# Altium schematic sheet Servo_Connector.SchDoc
size A4
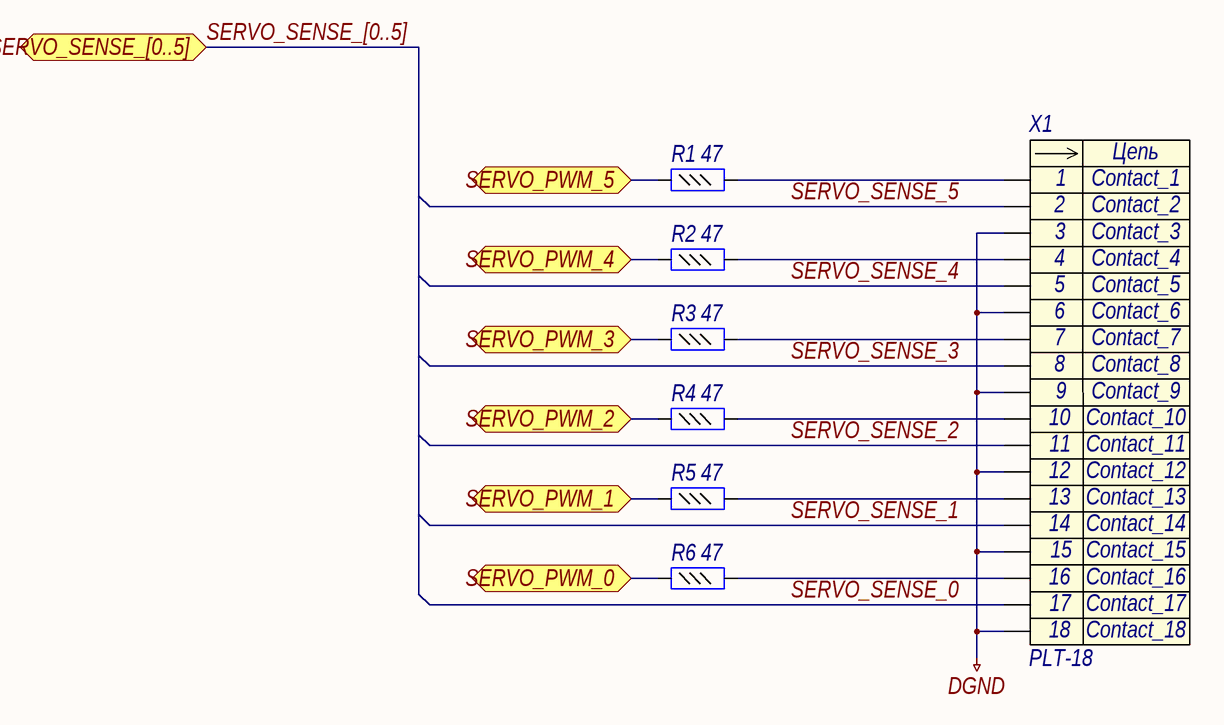
[diagram p0: Servo_Connector.SchDoc]

## Parts
R1  value 47  [R0603]  (hidden comment: Resistor_0,062Вт)
R2  value 47  [R0603]  (hidden comment: Resistor_0,062Вт)
R3  value 47  [R0603]  (hidden comment: Resistor_0,062Вт)
R4  value 47  [R0603]  (hidden comment: Resistor_0,062Вт)
R5  value 47  [R0603]  (hidden comment: Resistor_0,062Вт)
R6  value 47  [R0603]  (hidden comment: Resistor_0,062Вт)
X1  PLT-18  [PLT-18]

## Ports
SERVO_PWM_0, SERVO_PWM_1, SERVO_PWM_2, SERVO_PWM_3, SERVO_PWM_4, SERVO_PWM_5, SERVO_SENSE_[0..5]

## Nets
DGND: X1.3 X1.6 X1.9 X1.12 X1.15 X1.18
SERVO_PWM_0: R6.1 ; port SERVO_PWM_0
SERVO_PWM_1: R5.1 ; port SERVO_PWM_1
SERVO_PWM_2: R4.1 ; port SERVO_PWM_2
SERVO_PWM_3: R3.1 ; port SERVO_PWM_3
SERVO_PWM_4: R2.1 ; port SERVO_PWM_4
SERVO_PWM_5: R1.1 ; port SERVO_PWM_5
SERVO_SENSE_0: X1.17
SERVO_SENSE_1: X1.14
SERVO_SENSE_2: X1.11
SERVO_SENSE_3: X1.8
SERVO_SENSE_4: X1.5
SERVO_SENSE_5: X1.2
NetR1_2: R1.2 X1.1
NetR2_2: R2.2 X1.4
NetR3_2: R3.2 X1.7
NetR4_2: R4.2 X1.10
NetR5_2: R5.2 X1.13
NetR6_2: R6.2 X1.16

## Buses and harness runs
bus SERVO_SENSE_[0..5] = port SERVO_SENSE_[0..5]

## Notes on the sheet
- (in symbol connect129) Цепь

## Library data of the parts
R1-R6 = res431: Резистор; Manufacture: Yageo; Part Number: RC0603FR-0747RL; id: res431; Accuracy: 0,01; Part Name: Resistor; Power: 0,062Вт
X1 = connect129: Разъем - 18 конт. вилка; Part Number: PLT-81; Manufacture: Ningbo connfly electronic; Etch: 2.54mm; Part Name: PLT-18; Contact_1: Contact_1; Contact_2: Contact_2; Contact_3: Contact_3; Contact_4: Contact_4; Contact_5: Contact_5; Contact_6: Contact_6; id: connect129; Contact_7: Contact_7; Contact_8: Contact_8; Contact_9: Contact_9; Contact_10: Contact_10; Contact_11: Contact_11; Contact_12: Contact_12; Contact_13: Contact_13; Contact_14: Contact_14; Contact_15: Contact_15; Contact_16: Contact_16; Contact_17: Contact_17; Contact_18: Contact_18; Contact_19: Contact_19; Contact_20: Contact_20